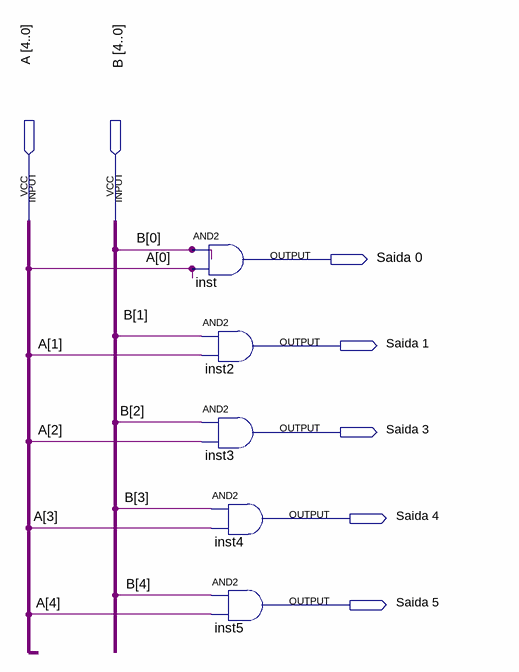
[diagram p0: schematic sheet]
// Quartus schematic And.bdf as structural Verilog: 5 symbols, 7 pins
module And (
  input  [4:0] A,
  input  [4:0] B,
  output \Saida_0 ,
  output \Saida_1 ,
  output \Saida_3 ,
  output \Saida_4 ,
  output \Saida_5 
);

  and inst (\Saida_0 , B[0], A[0]);
  and inst2 (\Saida_1 , B[1], A[1]);
  and inst3 (\Saida_3 , B[2], A[2]);
  and inst4 (\Saida_4 , B[3], A[3]);
  and inst5 (\Saida_5 , B[4], A[4]);
endmodule
